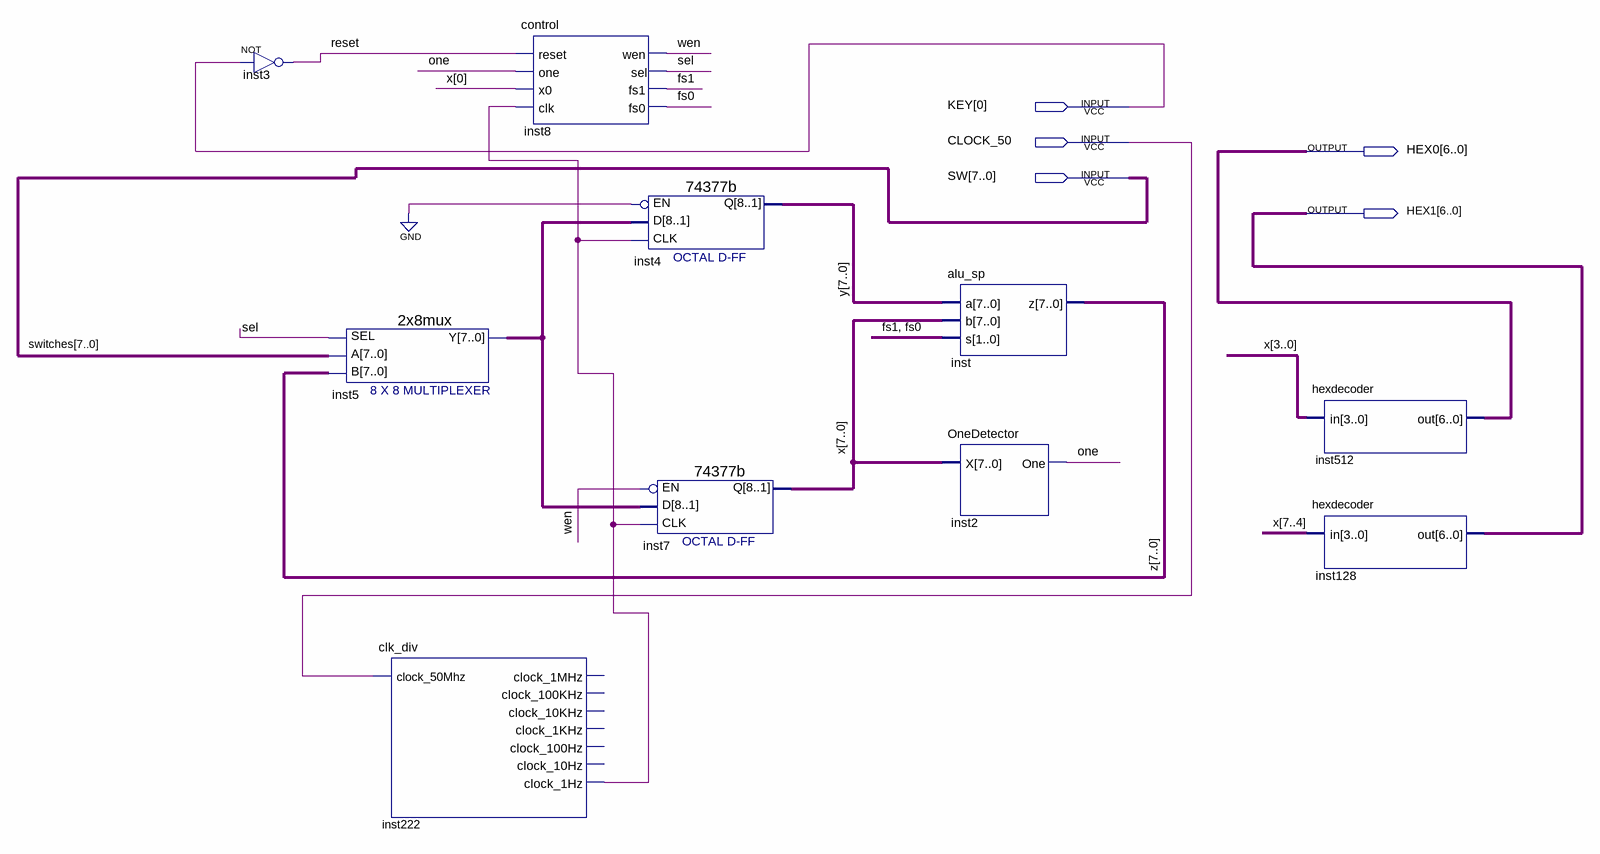
[diagram p0: schematic sheet]
// Quartus schematic statemachine.bdf as structural Verilog: 10 symbols, 5 pins
module statemachine (
  input  [0:0] KEY,
  input  CLOCK_50,
  input  [7:0] SW,
  output [6:0] HEX0,
  output [6:0] HEX1
);

  wire fs0, fs1, inst222_clock_1hz, one, reset, sel, wen;
  wire [7:0] inst5_y, x, y, z;

  not inst3 (reset, KEY[0]);
  \2x8mux  inst5 (.SEL(sel), .A(SW), .B(z), .Y(inst5_y));
  clk_div inst222 (
    .clock_50Mhz(CLOCK_50), .clock_1Hz(inst222_clock_1hz));  // open: clock_1MHz, clock_100KHz, clock_10KHz, clock_1KHz, clock_100Hz, clock_10Hz
  control inst8 (
    .reset(reset), .one(one), .x0(x[0]), .clk(inst222_clock_1hz), .wen(wen), .sel(sel), .fs1(fs1), .fs0(fs0));
  \74377b  inst4 (.CLK(inst222_clock_1hz), .EN(1'b0), .D(inst5_y), .Q(y));
  \74377b  inst7 (.CLK(inst222_clock_1hz), .EN(wen), .D(inst5_y), .Q(x));
  alu_sp inst (.a(y), .b(x), .s({fs1, fs0}), .z(z));
  OneDetector inst2 (.X(x), .One(one));
  hexdecoder inst512 (.in(x[3:0]), .out(HEX0));
  hexdecoder inst128 (.in(x[7:4]), .out(HEX1));

  // Other names for the same wires on the sheet: switches[7:0] = SW
endmodule
